# EAGLE design FTDI_only (EAGLE 8.1.0)
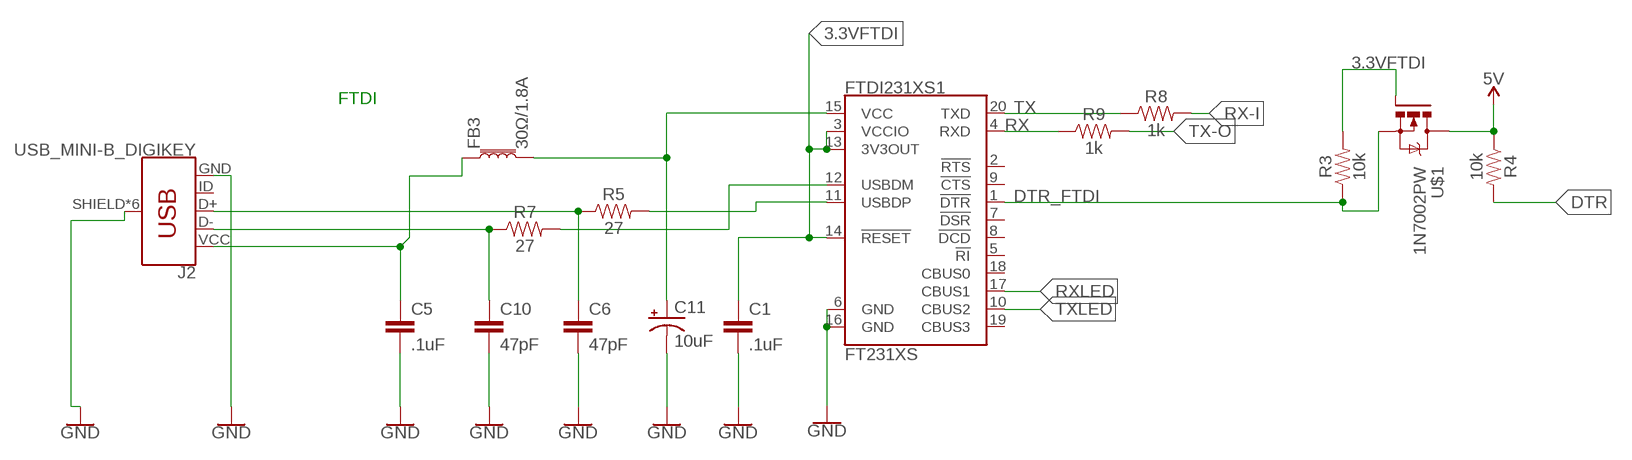
[diagram p0: schematic, sheet 1]

## Parts
C1  .1uF  .22UF-CER  [0402-CAP]
C5  .1uF  .22UF-CER  [0402-CAP]
C6  47pF  .22UF-CER  [0402-CAP]
C10  47pF  .22UF-CER  [0402-CAP]
C11  10uF  10UF-TANT  [EIA3216]
FB3  30Ω/1.8A  FERRITE_BEAD-0603  [0603]
FTDI231XS1  FT231XS  [SSOP20_L]
J2  USB_MINI-B_DIGIKEY  [MICRO-USB-DIGIKEY-FCI2]
R3  10k  0.05OHM-0603-1/5W-1%  [0603]
R4  10k  0.05OHM-0603-1/5W-1%  [0603]
R5  27  0.05OHM-0603-1/5W-1%  [0603]
R7  27  0.05OHM-0603-1/5W-1%  [0603]
R8  1k  0.05OHM-0603-1/5W-1%  [0603]
R9  1k  0.05OHM-0603-1/5W-1%  [0603]
U$1  1N7002PW  [SOT323W_INFINEON]

## Nets
3.3VFTDI: C1.1 FTDI231XS1.3(VCCIO) FTDI231XS1.13(3V3OUT) FTDI231XS1.14(!RESET) R3.2 U$1.1(G)
5V: R4.1 U$1.3(D)
DN_N: C10.1 J2.D- R7.1
DN_P: C6.1 J2.D+ R5.1
DTR: R4.2
DTR_FTDI: FTDI231XS1.1(!DTR) R3.1 U$1.2(S)
GND: C1.2 C5.2 C6.2 C10.2 C11.C(-) FTDI231XS1.6(GND) FTDI231XS1.16(GND) J2.GND J2.SHIELD J2.SHIELD1(SHIELD) J2.SHIELD2(SHIELD) J2.SHIELD3(SHIELD) J2.SHIELD4(SHIELD) J2.SHIELD5(SHIELD)
RX: FTDI231XS1.4(RXD) R9.1
RX-I: R8.2
RXLED: FTDI231XS1.17(CBUS1)
TX: FTDI231XS1.20(TXD) R8.1
TX-O: R9.2
TXLED: FTDI231XS1.10(CBUS2)
USBD_N: FTDI231XS1.12(USBDM) R7.2
USBD_P: FTDI231XS1.11(USBDP) R5.2
VUSB: C5.1 C11.A(+) FB3.1 FB3.2 FTDI231XS1.15(VCC) J2.VCC(VBUS)
Unconnected: FTDI231XS1.2(!RTS) FTDI231XS1.5(!RI) FTDI231XS1.7(!DSR) FTDI231XS1.8(!DCD) FTDI231XS1.9(!CTS) FTDI231XS1.18(CBUS0) FTDI231XS1.19(CBUS3) J2.ID

## Notes on the sheet
- FTDI

## Library data of the parts
C1 C5 C6 C10 = SparkFun-Retired:.22UF-CER: .22uF ceramic SMT CAP-09885- 50V +80%/-20% (0603); PROD_ID: CAP-09885; VALUE: .22uF
C11 = SparkFun-Retired:10UF-TANT: 10uF Tantalum SMT CAP-00811- 16V 10% (EIA-3216); PROD_ID: CAP-00811
FB3 = SparkFun-Coils:FERRITE_BEAD: Ferrite Bead (blocks, cores, rings, chokes, etc.) Inductor with layers of ferrite used to suppress high frequencies. Often used to isolate high frequency noise. SparkFun Products: IOIO-OTG - V2.2 <https://www.sparkfun.com/products/13613> SparkFun SAMD21 Mini Breakout <https://www.sparkfun.com/products/13664> SparkFun 6 Degrees of Freedom Breakout - LSM6DS3 <https://www.sparkfun.com/products/13339> SparkFun SAMD21 Dev Breakout <https://www.sparkfun.com/products/13672>; PROD_ID: NDUC-07859
FTDI231XS1 = SparkFun-IC-Comms:FT231X: FTDI FT231X Full Speed USB to Full-handshake UART This USB2.0 Full Speed IC offers a compact bridge to full handshake UART interfaces. The device is a UART, capable of operating up to 3MBaud, with low power consumption (8mA). The FT231X includes the complete FT-X series feature set and enables USB to be added into a system design quickly and easily over a UART interface. Datasheet <http://cdn.sparkfun.com/datasheets/Components/General%20IC/DS_FT231X.pdf> SparkFun Products SparkFun RedBoard - Programmed with Arduino <https://www.sparkfun.com/products/12757> (DEV-12757) SparkFun XBee Explorer USB <https://www.sparkfun.com/products/11812> (WRL-11812) SparkFun XBee Explorer Dongle <https://www.sparkfun.com/products/11697> (WRL-11697) SparkFun Blynk Board - ESP8266 <https://www.sparkfun.com/products/13794> (WRL-13794) SparkFun ESP8266 Thing - Dev Board <https://www.sparkfun.com/products/13711> (WRL-13711) SparkFun Block for Intel® Edison - Base <https://www.sparkfun.com/products/13045> (DEV-13045) SparkFun RedStick <https://www.sparkfun.com/products/13741> (DEV-13741) SparkFun Beefy 3 - FTDI Basic Breakout <https://www.sparkfun.com/products/13746> (DEV-13746) SparkFun FT231X Breakout <https://www.sparkfun.com/products/11736> (BOB-11736); PROD_ID: IC-11524
J2 = KevinKuwata1:USB_MINI-B_DIGIKEY: USB type Mini-B Connector Breaks out 5th pin, and includes shield pins if needed. SparkFun Products: SparkFun FTDI Basic Breakout <https://www.sparkfun.com/products/9716> SparkFun XBee Explorer USB <https://www.sparkfun.com/products/11812> SparkFun Redboard <https://www.sparkfun.com/products/12757>
R3-R5 R7-R9 = SparkFun-Resistors:0.05OHM: 0.05Ω resistor A resistor is a passive two-terminal electrical component that implements electrical resistance as a circuit element. Resistors act to reduce current flow, and, at the same time, act to lower voltage levels within circuits. - Wikipedia; PROD_ID: RES-12535; VALUE: 0.05
U$1 = KevinKuwata1:1N7002PW

## Net classes
0 default: clearance 0.051 mm

## Board
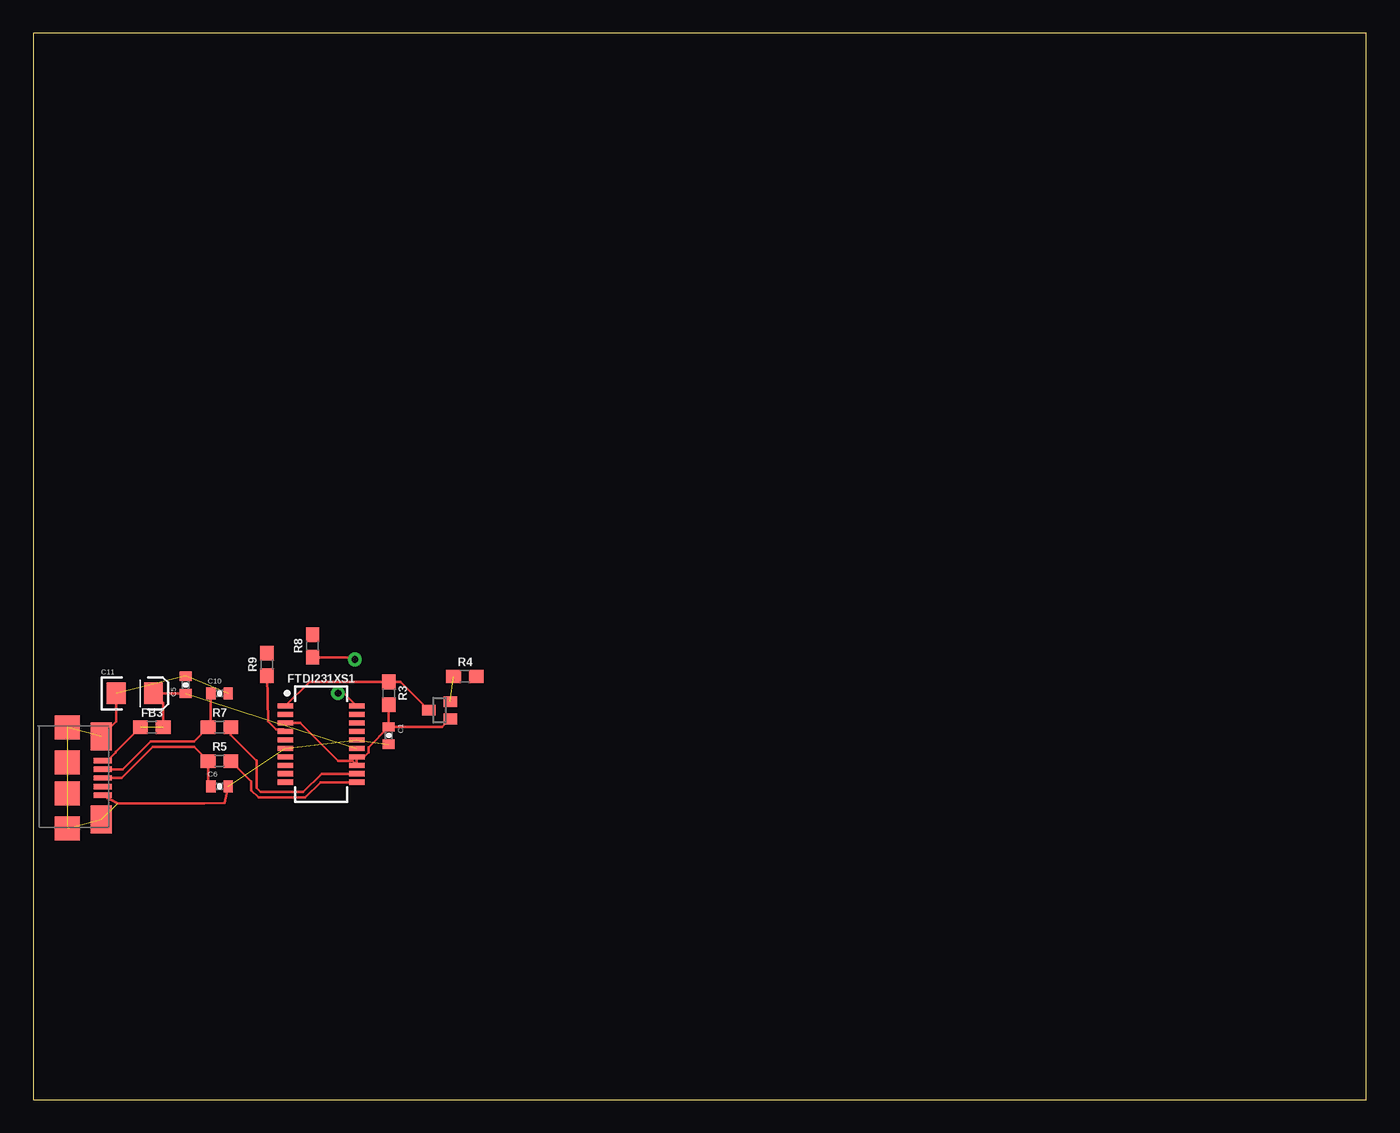
[diagram p1: board, top side]
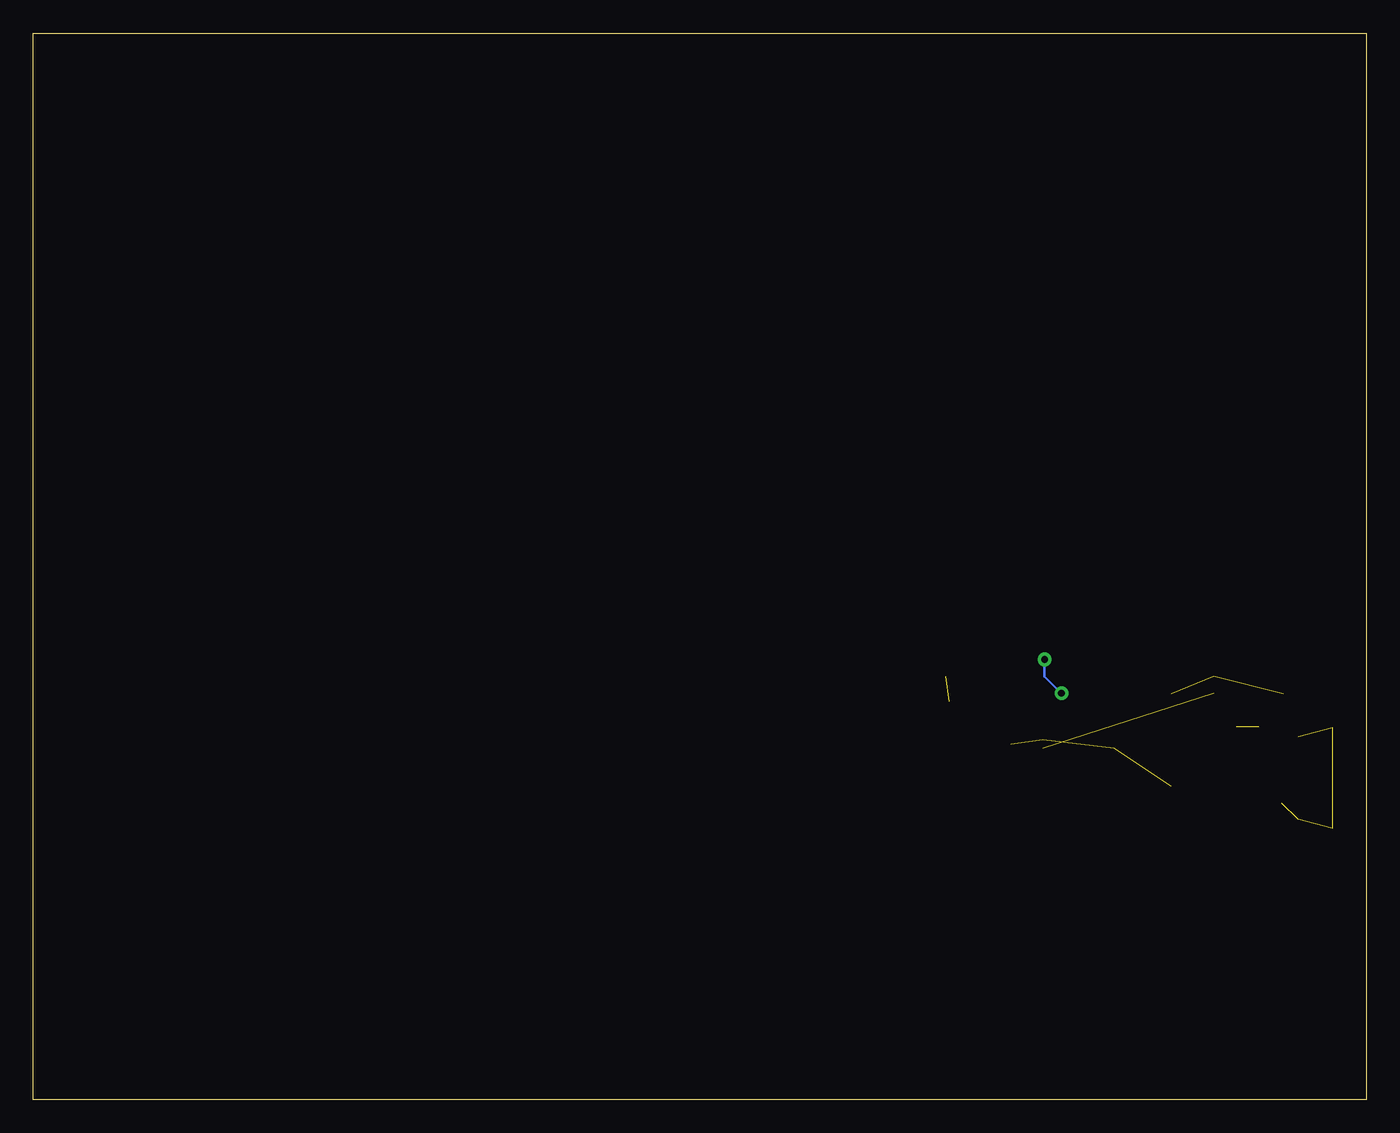
[diagram p2: board, bottom side, seen from below]

Size 100 x 80 mm. Coordinates in mm from the lower left corner, seen from the top.
Outline: 0,0 100,0 100,80 0,80 0,0
Copper layers (1*16): Top 0.035mm / dielectric 1.5mm / Bottom 0.035mm
Design rules "SparkFun": minimum track width 8mil, minimum drill 20mil, track to track 8mil, track to pad 8mil, pad to pad 8mil, via to via 8mil, smd to smd 8mil, copper to edge 10mil, drill to drill 8mil, minimum pad ring 12mil, minimum via ring 10mil, stop-mask expansion 4mil, vias tented up to drill 25mil, thermal gap 10mil

### Footprints (pad centres in the part's own frame; a part is rotated, then mirrored left to right if it is on the bottom)
0402-CAP = smd 0.7 x 0.9: 1 -0.65,0; 2 0.65,0
EIA3216 = smd 1.4 x 1.6: A 1.4,0; C -1.4,0
0603 = smd 1.1 x 1: 1 -0.85,0; 2 0.85,0
SSOP20_L = smd 0.381 x 1.143: 1 -2.857,-2.68; 2 -2.223,-2.68; 3 -1.587,-2.68; 4 -0.953,-2.68; 5 -0.318,-2.68; 6 0.318,-2.68; 7 0.953,-2.68; 8 1.587,-2.68; 9 2.223,-2.68; 10 2.857,-2.68; 11 2.857,2.68; 12 2.223,2.68; 13 1.587,2.68; 14 0.953,2.68; 15 0.318,2.68; 16 -0.318,2.68; 17 -0.953,2.68; 18 -1.587,2.68; 19 -2.223,2.68; 20 -2.857,2.68
MICRO-USB-DIGIKEY-FCI2 = smd 0.4 x 1.35: D+ 0,2.67; D- -0.65,2.67; GND 1.3,2.67; ID 0.65,2.67; VCC -1.3,2.67 | smd 2.1 x 1.6: SHIELD -3.1,2.55; SHIELD1 3.1,2.55 | smd 1.8 x 1.9: SHIELD2 -3.8,0; SHIELD3 -1.15,0; SHIELD4 1.15,0; SHIELD5 3.8,0
SOT323W_INFINEON = smd 1 x 0.8: 1 -0.8,0.65; 2 0.8,0; 3 -0.8,-0.65

### Placement (x,y rotation side)
C1  26.67,27.3 270 top
C5  11.43,31.11 90 top
C6  13.97,23.5 0 top
C10  13.97,30.48 0 top
C11  7.62,30.48 0 top
FB3  8.89,27.94 0 top
FTDI231XS1  21.59,26.67 270 top
J2  2.54,24.13 270 top
R3  26.67,30.48 270 top
R4  32.38,31.75 0 top
R5  13.97,25.4 0 top
R7  13.97,27.94 0 top
R8  20.95,34.04 90 top
R9  17.53,32.64 90 top
U$1  30.48,29.21 180 top

### Tracks (layer width: path | path; a pad name or v marks a point on that pad's centre or on a via)
3.3VFTDI
  Top 0.203: FTDI231XS1.3 20,28.26 22.86,25.4 23.95,25.4 FTDI231XS1.13 FTDI231XS1.14 24.83,25.72 25.15,26.04 25.15,26.43 C1.1 | R3.2 C1.1 | U$1.1 30.68,27.95 C1.1
5V  (1 unrouted)
DN_N
  Top 0.203: J2.D- 6.71,24.78 8.81,26.87 12.05,26.87 R7.1 13.32,28.14 C10.1
DN_P
  Top 0.203: J2.D+ 6.64,24.13 8.97,26.47 12.05,26.47 R5.1 13.12,23.7 C6.1
DTR_FTDI
  Top 0.203: FTDI231XS1.1 20.71,31.33 R3.1 27.56,31.33 U$1.2
GND  (11 unrouted)
  Top 0.203: C11.C 6.22,28.36 J2.SHIELD | J2.GND 6.32,22.23 12.83,22.23 14.37,22.24 C6.2
RX
  Top 0.203: FTDI231XS1.4 18.77,27.76 18.21,27.76 17.61,28.36 R9.1
TX  (via drill 0.51)
  Top 0.203: FTDI231XS1.20 23.32,30.48 v22.86,30.48 | v24.13,33.02 23.96,33.19 R8.1
  Bottom 0.203: v22.86,30.48 24.13,31.75 v24.13,33.02
USBD_N
  Top 0.203: FTDI231XS1.12 21.62,24.45 20.24,23.06 17.07,23.06 16.76,23.37 16.76,25.4 | 14.82,27.38 R7.2 14.82,27.34 16.76,25.4 | 16.76,25.43 16.76,25.4
USBD_P
  Top 0.203: R5.2 16.36,23.86 16.36,23.2 16.9,22.66 20.4,22.66 21.56,23.81 FTDI231XS1.11
VUSB  (2 unrouted)
  Top 0.203: FB3.1 6.2,26.09 6.2,26.05 5.57,25.43 J2.VCC | FB3.2 9.74,29.76 C11.A 9.04,30.46 C5.1